# Altium schematic sheet SWD.SchDoc
size A; SheetNumber: 6; SheetTotal: 8
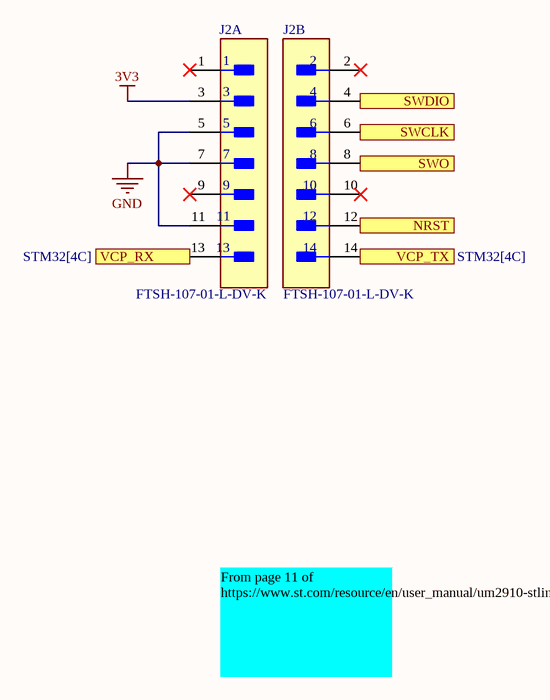
[diagram p0: SWD.SchDoc]

## Parts
J2  FTSH-107-01-L-DV-K  [FP-FTSH-107-01-L-DV-K-MFG]  (parts A,B of 2)

## Ports
NRST (see STM32[4C]), SWCLK (see STM32[4C]), SWDIO (see STM32[4C]), SWO (see STM32[4C]), VCP_RX (see STM32[4C]), VCP_TX (see STM32[4C])

## Nets
3V3: J2.3
GND: J2.5 J2.7 J2.11
NRST: J2.12 ; port NRST
SWCLK: J2.6 ; port SWCLK
SWDIO: J2.4 ; port SWDIO
SWO: J2.8 ; port SWO
VCP_RX: J2.13 ; port VCP_RX
VCP_TX: J2.14 ; port VCP_TX

Not connected (* = marked no-connect by the designer): J2 1* 2* 9* 10*

## Notes on the sheet
- From page 11 of
  https://www.st.com/resource/en/user_manual/um2910-stlinkv3minie-debuggerprogrammer-tiny-probe-for-stm32-microcontrollers-stmicroelectronics.pdf

## Library data of the parts
J2 = CMP-02766-001412-1: CONN HEADER SMD 14POS 1.27MM; Number of Contacts: 14; Gender: Male; Termination: Solder; Lead Free: Lead Free; Depth: 5.84mm; Min Operating Temperature: -55°C; Length: 8.89mm; RoHS Compliant: Yes; Housing Material: Polymer; Housing Color: Black; Max Operating Temperature: 125°C; Number of Rows: 2; Pitch: 1.27mm; Radiation Hardening: No; Orientation: Straight; Packaging: Rail/Tube; Contact Material: Bronze; Contact Plating: Gold